# Altium schematic sheet 9.RGB&TOUCH.SchDoc
size A3
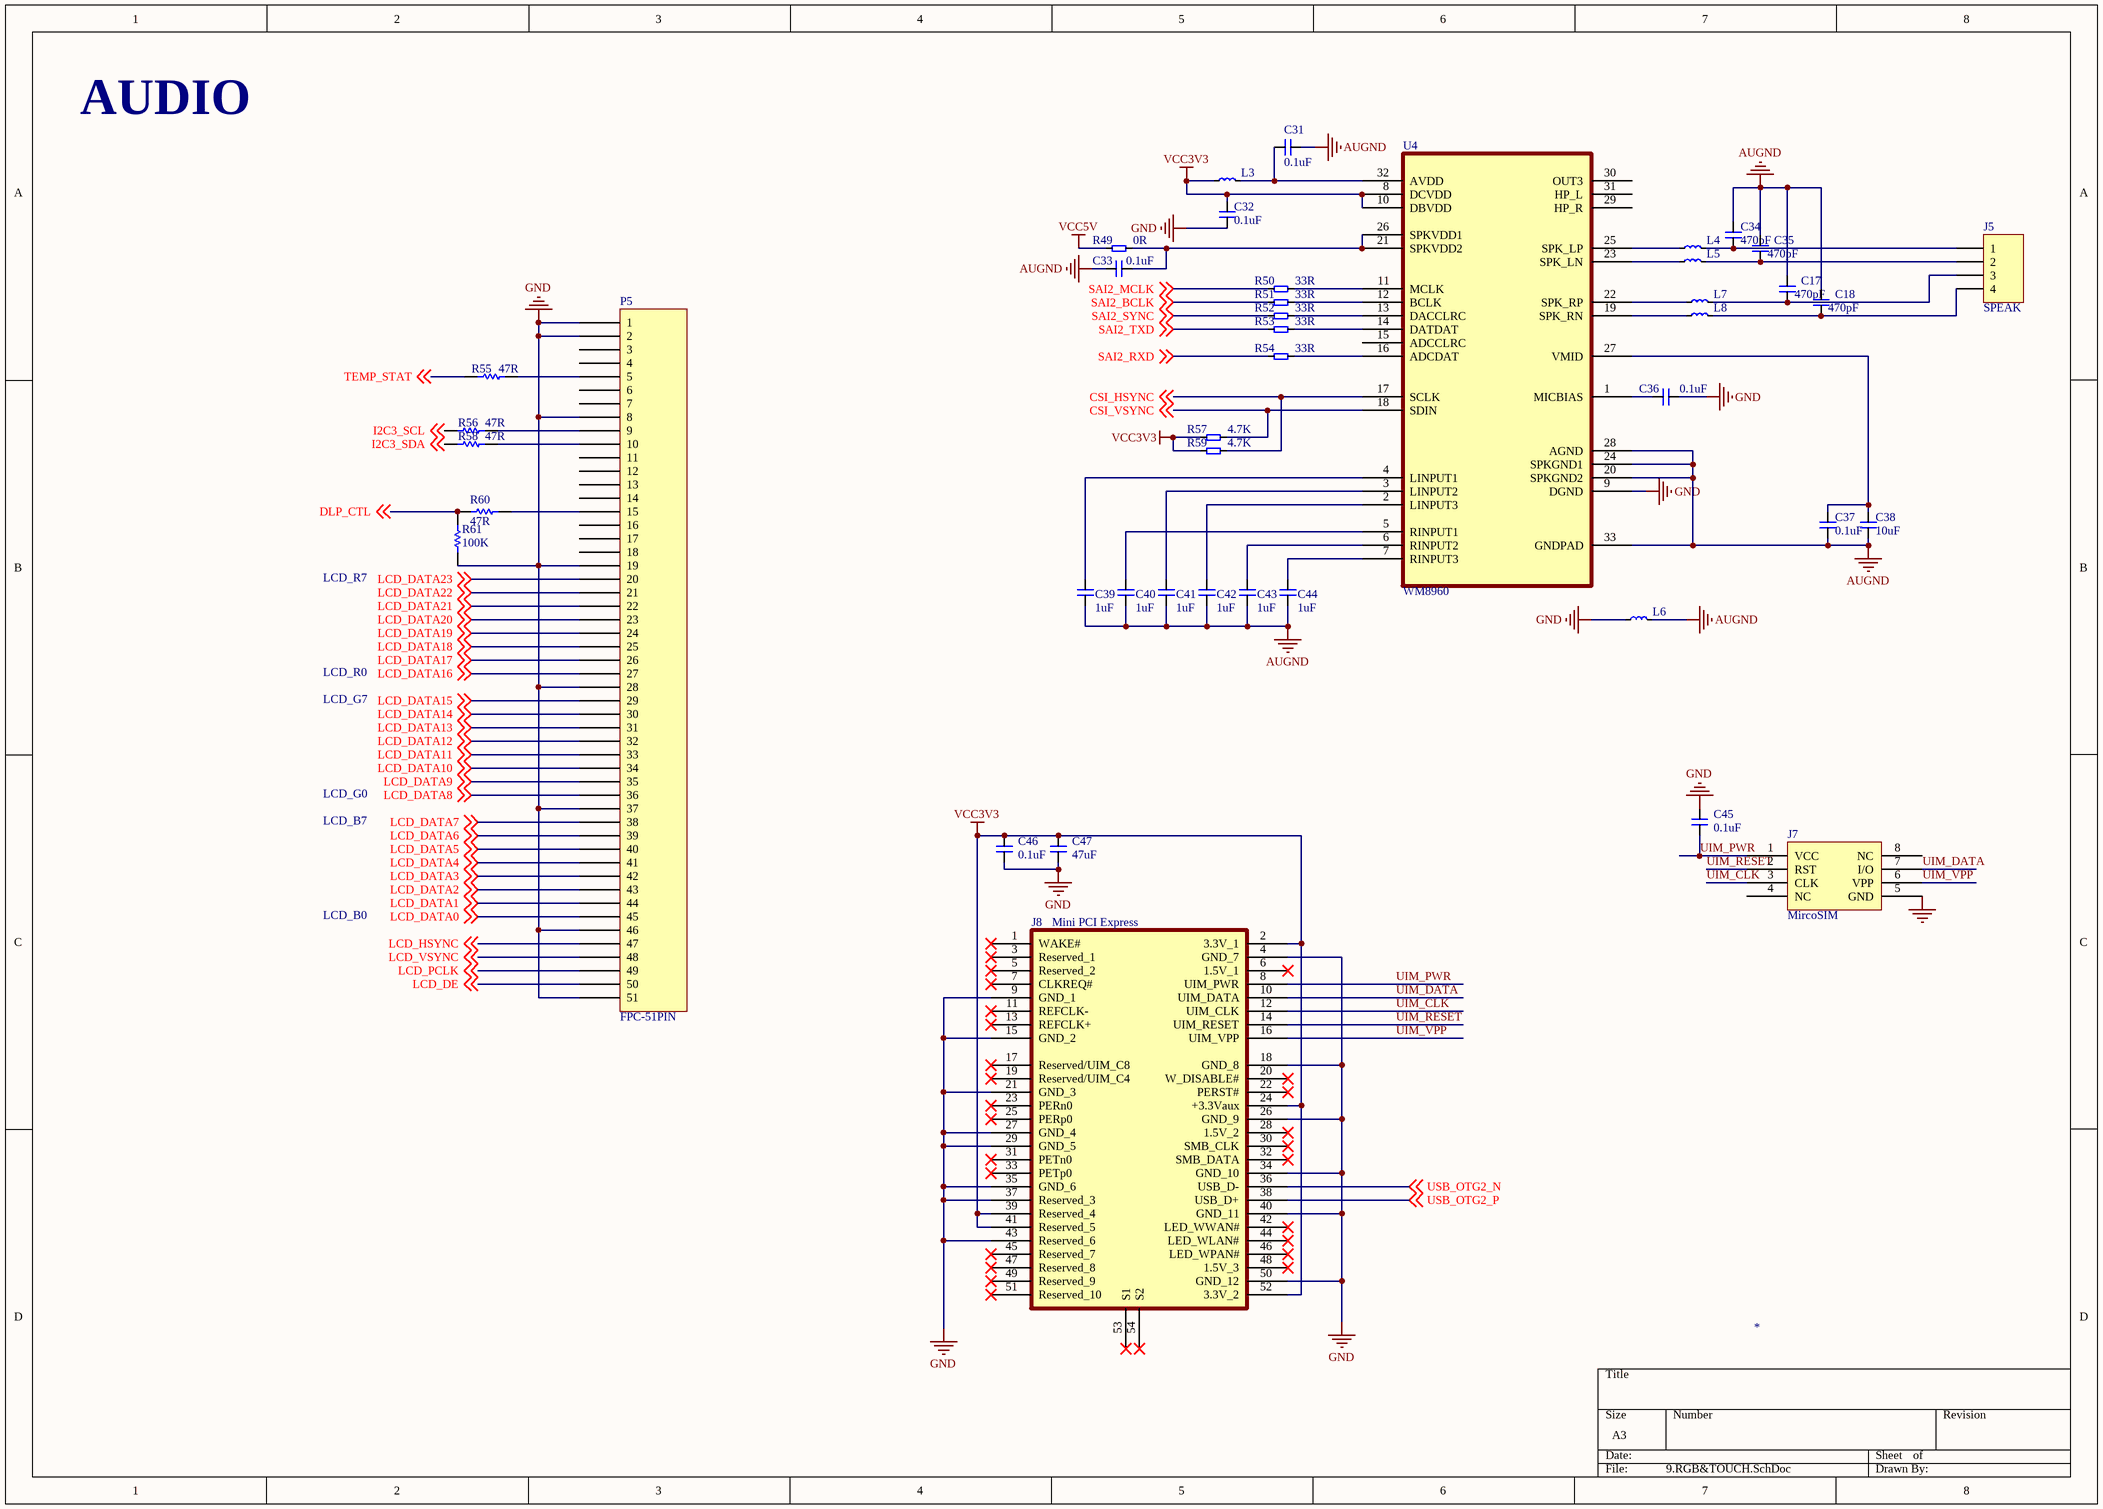
[diagram p0: 9.RGB&TOUCH.SchDoc]

## Parts
C17  470pF  [0603C]
C18  470pF  [0603C]
C31  0.1uF  [0603C]
C32  0.1uF  [0603C]
C33  0.1uF  [0603C]
C34  470pF  [0603C]
C35  470pF  [0603C]
C36  0.1uF  [0603C]
C37  0.1uF  [0603C]
C38  10uF  [0805C]
C39  1uF  [0603C]
C40  1uF  [0603C]
C41  1uF  [0603C]
C42  1uF  [0603C]
C43  1uF  [0603C]
C44  1uF  [0603C]
C45  0.1uF  [0603C]
C46  0.1uF  [0603C]
C47  47uF  [1206C]
J5  SPEAK  [1.25-4P]
J7  MircoSIM  [Micro SIM]
J8  Mini PCI Express  [MINI-PCIE-SHORT]
L3  电感  [0603L]  (value not drawn)
L4  电感  [0603L]  (value not drawn)
L5  电感  [0603L]  (value not drawn)
L6  电感  [0603L]  (value not drawn)
L7  电感  [0603L]  (value not drawn)
L8  电感  [0603L]  (value not drawn)
P5  FPC-51PIN  [FH26-51S-0.3SHW]
R49  0R  [0603R]
R50  33R  [0603R]
R51  33R  [0603R]
R52  33R  [0603R]
R53  33R  [0603R]
R54  33R  [0603R]
R55  47R  [0603]
R56  47R  [0603]
R57  4.7K  [0603R]
R58  47R  [0603]
R59  4.7K  [0603R]
R60  47R  [0603]
R61  100K  [0603]
U4  WM8960  [QFN-32]

## Nets
AUGND: C17.2 C18.2 C31.2 C33.1 C34.2 C35.2 C37.2 C38.2 C39.1 C40.1 C41.1 C42.1 C43.1 C44.1 L6.2 U4.20(SPKGND2) U4.24(SPKGND1) U4.28(AGND) U4.33(GNDPAD)
GND: C32.2 C36.2 C45.1 C46.2 C47.2 J7.5(GND) J8.4(GND_7) J8.9(GND_1) J8.15(GND_2) J8.18(GND_8) J8.21(GND_3) J8.26(GND_9) J8.27(GND_4) J8.29(GND_5) J8.34(GND_10) J8.35(GND_6) J8.37(Reserved_3) J8.40(GND_11) J8.43(Reserved_6) J8.50(GND_12) L6.1 P5.1 P5.2 P5.8 P5.19 P5.28 P5.37 P5.46 P5.51 R61.1 U4.9(DGND)
VCC3V3: C32.1 C46.1 C47.1 J8.2(3.3V_1) J8.24(+3.3Vaux) J8.39(Reserved_4) J8.41(Reserved_5) J8.52(3.3V_2) L3.1 R57.1 R59.1 U4.8(DCVDD) U4.10(DBVDD)
VCC5V: R49.1
CSI_HSYNC: R59.2 U4.17(SCLK) ; off-sheet CSI_HSYNC
CSI_VSYNC: R57.2 U4.18(SDIN) ; off-sheet CSI_VSYNC
DLP_CTL: R60.1 R61.2 ; off-sheet DLP_CTL
I2C3_SCL: R56.1 ; off-sheet I2C3_SCL
I2C3_SDA: R58.1 ; off-sheet I2C3_SDA
LCD_DATA0: P5.45 ; off-sheet LCD_DATA0
LCD_DATA1: P5.44 ; off-sheet LCD_DATA1
LCD_DATA2: P5.43 ; off-sheet LCD_DATA2
LCD_DATA3: P5.42 ; off-sheet LCD_DATA3
LCD_DATA4: P5.41 ; off-sheet LCD_DATA4
LCD_DATA5: P5.40 ; off-sheet LCD_DATA5
LCD_DATA6: P5.39 ; off-sheet LCD_DATA6
LCD_DATA7: P5.38 ; off-sheet LCD_DATA7
LCD_DATA8: P5.36 ; off-sheet LCD_DATA8
LCD_DATA9: P5.35 ; off-sheet LCD_DATA9
LCD_DATA10: P5.34 ; off-sheet LCD_DATA10
LCD_DATA11: P5.33 ; off-sheet LCD_DATA11
LCD_DATA12: P5.32 ; off-sheet LCD_DATA12
LCD_DATA13: P5.31 ; off-sheet LCD_DATA13
LCD_DATA14: P5.30 ; off-sheet LCD_DATA14
LCD_DATA15: P5.29 ; off-sheet LCD_DATA15
LCD_DATA16: P5.27 ; off-sheet LCD_DATA16
LCD_DATA17: P5.26 ; off-sheet LCD_DATA17
LCD_DATA18: P5.25 ; off-sheet LCD_DATA18
LCD_DATA19: P5.24 ; off-sheet LCD_DATA19
LCD_DATA20: P5.23 ; off-sheet LCD_DATA20
LCD_DATA21: P5.22 ; off-sheet LCD_DATA21
LCD_DATA22: P5.21 ; off-sheet LCD_DATA22
LCD_DATA23: P5.20 ; off-sheet LCD_DATA23
LCD_DE: P5.50 ; off-sheet LCD_DE
LCD_HSYNC: P5.47 ; off-sheet LCD_HSYNC
LCD_PCLK: P5.49 ; off-sheet LCD_PCLK
LCD_VSYNC: P5.48 ; off-sheet LCD_VSYNC
SAI2_BCLK: R51.1 ; off-sheet SAI2_BCLK
SAI2_MCLK: R50.1 ; off-sheet SAI2_MCLK
SAI2_RXD: R54.1 ; off-sheet SAI2_RXD
SAI2_SYNC: R52.1 ; off-sheet SAI2_SYNC
SAI2_TXD: R53.1 ; off-sheet SAI2_TXD
TEMP_STAT: R55.1 ; off-sheet TEMP_STAT
UIM_CLK: J7.3(CLK) J8.12(UIM_CLK)
UIM_DATA: J7.7(I/O) J8.10(UIM_DATA)
UIM_PWR: C45.2 J7.1(VCC) J8.8(UIM_PWR)
UIM_RESET: J7.2(RST) J8.14(UIM_RESET)
UIM_VPP: J7.6(VPP) J8.16(UIM_VPP)
USB_OTG2_N: J8.36(USB_D-) ; off-sheet USB_OTG2_N
USB_OTG2_P: J8.38(USB_D+) ; off-sheet USB_OTG2_P
NetC17_1: C17.1 J5.3 L7.2
NetC18_1: C18.1 J5.4 L8.2
NetC31_1: C31.1 L3.2 U4.32(AVDD)
NetC33_2: C33.2 R49.2 U4.21(SPKVDD2) U4.26(SPKVDD1)
NetC34_1: C34.1 J5.1 L4.2
NetC35_1: C35.1 J5.2 L5.2
NetC36_1: C36.1 U4.1(MICBIAS)
NetC37_1: C37.1 C38.1 U4.27(VMID)
NetC39_2: C39.2 U4.4(LINPUT1)
NetC40_2: C40.2 U4.5(RINPUT1)
NetC41_2: C41.2 U4.3(LINPUT2)
NetC42_2: C42.2 U4.2(LINPUT3)
NetC43_2: C43.2 U4.6(RINPUT2)
NetC44_2: C44.2 U4.7(RINPUT3)
NetL4_1: L4.1 U4.25(SPK_LP)
NetL5_1: L5.1 U4.23(SPK_LN)
NetL7_1: L7.1 U4.22(SPK_RP)
NetL8_1: L8.1 U4.19(SPK_RN)
NetP5_5: P5.5 R55.2
NetP5_9: P5.9 R56.2
NetP5_10: P5.10 R58.2
NetP5_15: P5.15 R60.2
NetR50_2: R50.2 U4.11(MCLK)
NetR51_2: R51.2 U4.12(BCLK)
NetR52_2: R52.2 U4.13(DACCLRC)
NetR53_2: R53.2 U4.14(DATDAT)
NetR54_2: R54.2 U4.16(ADCDAT)

Not connected (* = marked no-connect by the designer): J7 4(NC) 8(NC); J8 1(WAKE#)* 3(Reserved_1)* 5(Reserved_2)* 6(1.5V_1)* 7(CLKREQ#)* 11(REFCLK-)* 13(REFCLK+)* 17(Reserved/UIM_C8)* 19(Reserved/UIM_C4)* 20(W_DISABLE#)* 22(PERST#)* 23(PERn0)* 25(PERp0)* 28(1.5V_2)* 30(SMB_CLK)* 31(PETn0)* 32(SMB_DATA)* 33(PETp0)* 42(LED_WWAN#)* 44(LED_WLAN#)* 45(Reserved_7)* 46(LED_WPAN#)* 47(Reserved_8)* 48(1.5V_3)* 49(Reserved_9)* 51(Reserved_10)* 53(S1)* 54(S2)*; P5 3 4 6 7 11 12 13 14 16 17 18; U4 15(ADCCLRC) 29(HP_R) 30(OUT3) 31(HP_L)

## Notes on the sheet
- AUDIO
- LCD_R7
- LCD_G7
- LCD_R0
- LCD_B7
- LCD_G0
- LCD_B0

## Library data of the parts
C17 C18 C31-C47 = 电容
J5 = Header 4: Header, 4-Pin; LatestRevisionDate: 17-Jul-2002; LatestRevisionNote: Re-released for DXP Platform.; Publisher: Altium Limited
J8 = MINIPCIE: MPC24-52K3311
R49-R54 R57 R59 = 电阻
R55 R56 R58 R60 R61 = Res1: Resistor